# EAGLE design Max3232_TTLtoRS232 (EAGLE 5.11)
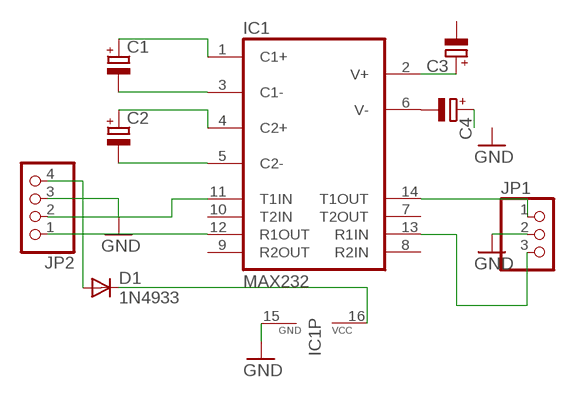
[diagram p0: schematic, sheet 1]

## Parts
C1  CPOL-EUE2,5-6E  [E2,5-6E]
C2  CPOL-EUE2,5-6E  [E2,5-6E]
C3  CPOL-EUE2,5-6E  [E2,5-6E]
C4  CPOL-EUE2,5-6E  [E2,5-6E]
D1  1N4933  [DO41-10]
IC1  MAX232  [DIL16]
JP1  PINHD-1X3  [1X03]
JP2  PINHD-1X4  [1X04]

## Nets
GND: IC1.15(GND) JP1.2 JP2.3
N$1: C1.+ IC1.1(C1+)
N$2: C1.- IC1.3(C1-)
N$3: C2.+ IC1.4(C2+)
N$4: C2.- IC1.5(C2-)
N$5: D1.A JP2.4
N$6: C3.+ IC1.2(V+)
N$7: D1.C IC1.16(VCC)
N$8: IC1.14(T1OUT) JP1.1
N$9: IC1.13(R1IN) JP1.3
N$10: IC1.11(T1IN) JP2.2
N$11: IC1.12(R1OUT) JP2.1
N$12: C4.- IC1.6(V-)
N$13: C4.+
Unconnected: C3.- IC1.7(T2OUT) IC1.8(R2IN) IC1.9(R2OUT) IC1.10(T2IN)

## Library data of the parts
C1-C4 = rcl:CPOL-EU: POLARIZED CAPACITOR, European symbol
D1 = diode:1N4933: DIODE fast recovery rectifier, 1A
IC1 = maxim:MAX232: RS232 TRANSEIVER; MF: MAXIM; MPN: MAX232ACPE+; OC_FARNELL: 9723773; OC_NEWARK: 68K4544
JP1 = pinhead:PINHD-1X3: PIN HEADER
JP2 = pinhead:PINHD-1X4: PIN HEADER

## Board
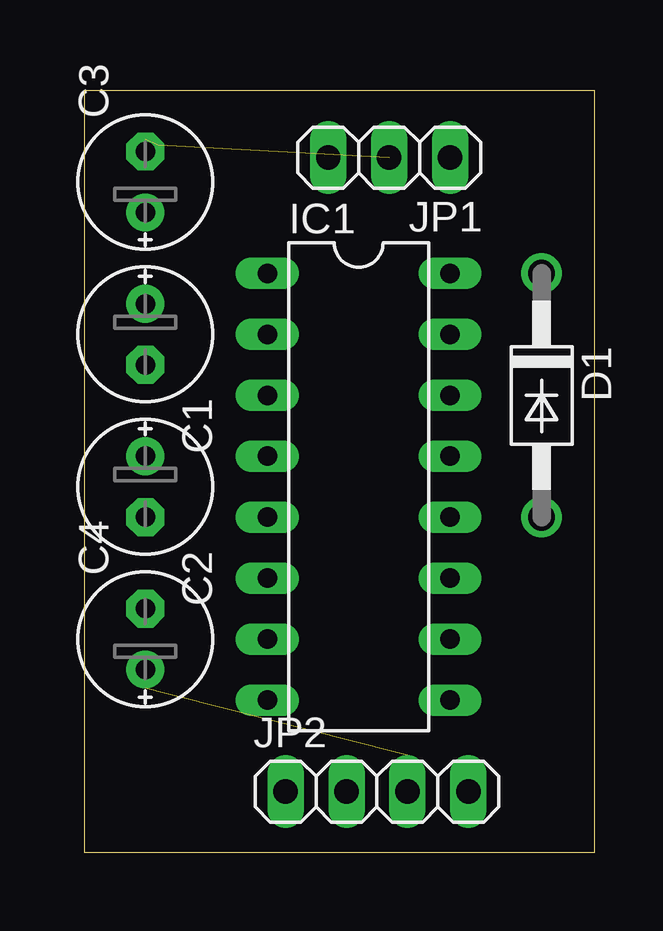
[diagram p1: board, top side]
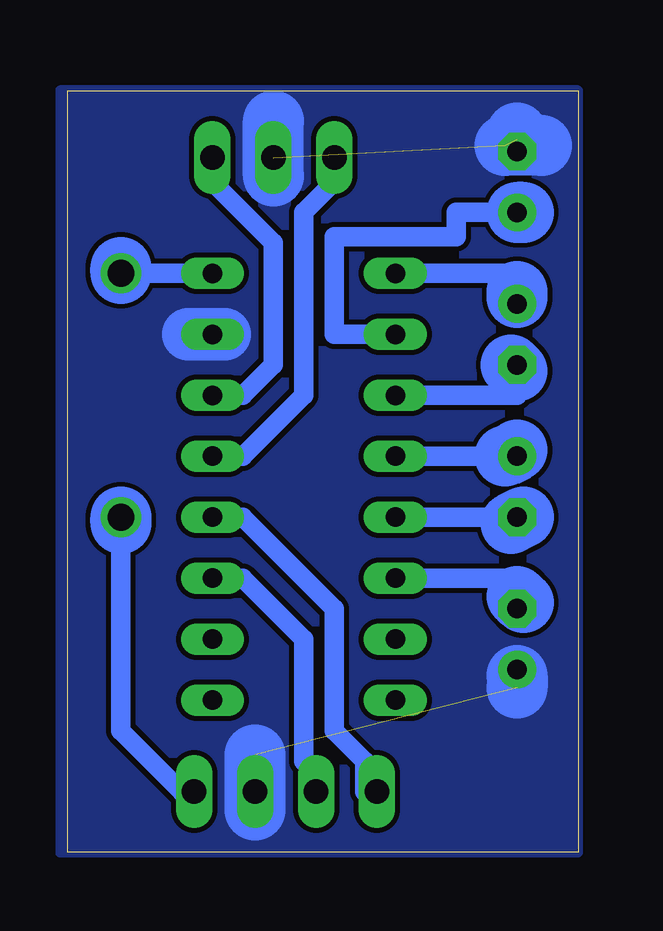
[diagram p2: board, bottom side, seen from below]

Size 21.26 x 31.74 mm. Coordinates in mm from the lower left corner, seen from the top.
Outline: 0,0 21.26,0 21.26,31.74 0,31.74 0,0
Copper layers (1*16): Top 0.035mm / dielectric 1.5mm / Bottom 0.035mm
Design rules "default *": minimum track width 10mil, minimum drill 24mil, track to track 8mil, track to pad 8mil, pad to pad 8mil, via to via 8mil, smd to smd 8mil, copper to edge 0mil, drill to drill 8mil, minimum pad ring 10mil, minimum via ring 8mil, stop-mask expansion 4mil, vias tented up to drill 0mil, thermal gap 10mil

### Footprints (pad centres in the part's own frame; a part is rotated, then mirrored left to right if it is on the bottom)
E2,5-6E = drill 0.813 pad 1.575 round: + -1.27,0 | drill 0.813 pad 1.575 octagon: - 1.27,0
DO41-10 = drill 1.118 round: A 5.08,0; C -5.08,0
DIL16 = drill 0.813 long: 1 -8.89,-3.81; 2 -6.35,-3.81; 3 -3.81,-3.81; 4 -1.27,-3.81; 5 1.27,-3.81; 6 3.81,-3.81; 7 6.35,-3.81; 8 8.89,-3.81; 9 8.89,3.81; 10 6.35,3.81; 11 3.81,3.81; 12 1.27,3.81; 13 -1.27,3.81; 14 -3.81,3.81; 15 -6.35,3.81; 16 -8.89,3.81
1X03 = drill 1.016 long: 1 -2.54,0; 2 0,0; 3 2.54,0
1X04 = drill 1.016 long: 1 -3.81,0; 2 -1.27,0; 3 1.27,0; 4 3.81,0

### Placement (x,y rotation side)
C1  2.54,21.59 270 top
C2  2.54,15.24 270 top
C3  2.54,27.94 90 top
C4  2.54,8.89 90 top
D1  19.05,19.05 270 top
IC1  11.43,15.24 270 top
JP1  12.7,28.96 180 top
JP2  12.19,2.54 0 top

### Tracks (layer width: path | path; a pad name or v marks a point on that pad's centre or on a via)
GND  (3 unrouted)
  Bottom 2.184: 14.73,21.59 IC1.15 16.26,21.59
  Bottom 2.54: 12.7,28.19 12.7,30.48 | 13.46,1.78 13.46,4.06 | 2.54,29.72 2.54,29.97 | 1.52,29.46 3.05,29.46 | 2.54,7.37 2.54,6.86
  pour Bottom: 0,31.75 21.59,31.75 21.59,0 0,0
N$1
  Bottom 0.406: C1.+ 2.54,23.11 | 2.54,23.37 2.54,24.13
  Bottom 0.813: 2.54,24.13 IC1.1
  Bottom 2.54: 2.54,23.11 2.54,23.37
N$2
  Bottom 0.406: 2.54,19.05 2.54,20.07 C1.-
  Bottom 0.813: 2.54,19.05 IC1.3
  Bottom 2.54: 2.54,20.07 2.79,20.32
N$3
  Bottom 0.406: C2.+ 3.05,16.51
  Bottom 0.813: 3.05,16.51 IC1.4
  Bottom 2.54: 3.05,16.51 2.54,16.76
N$4
  Bottom 0.813: C2.- IC1.5
N$5
  Bottom 0.254: JP2.4 16.51,2.54
  Bottom 0.813: 16.51,2.54 19.05,5.08 19.05,13.72
  Bottom 2.54: 19.05,13.72 D1.A
N$6
  Bottom 0.813: C3.+ 5.08,26.67 5.08,25.65 10.16,25.65 10.16,21.59 IC1.2
  Bottom 2.54: 2.29,26.67 C3.+
N$7
  Bottom 0.813: IC1.16 D1.C
  Bottom 2.54: D1.C 19.05,24.38
N$8
  Bottom 0.813: IC1.14 13.97,19.05 12.7,20.32 12.7,25.4 15.24,27.94 JP1.1
N$9
  Bottom 0.813: IC1.13 13.97,16.51 11.43,19.05 11.43,26.67 10.16,27.94 JP1.3
N$10
  Bottom 0.813: IC1.11 13.97,11.43 11.43,8.89 11.43,3.81 10.92,3.3 JP2.2
N$11
  Bottom 0.813: IC1.12 13.97,13.97 10.16,10.16 10.16,5.08 8.89,3.81 8.89,2.54 JP2.1
N$12
  Bottom 0.406: C4.- 2.54,10.67 2.54,11.43
  Bottom 0.813: 2.54,11.43 IC1.6
  Bottom 2.54: 2.29,10.41 2.54,10.67
N$14
  Bottom 2.54: 2.29,13.97 2.79,13.72